# EAGLE design IMU_SMD (EAGLE 7.4.0)
CNAME: Inertia Meaurement Unit; CREVISION: 1.0; DESIGNER: Ye Wang
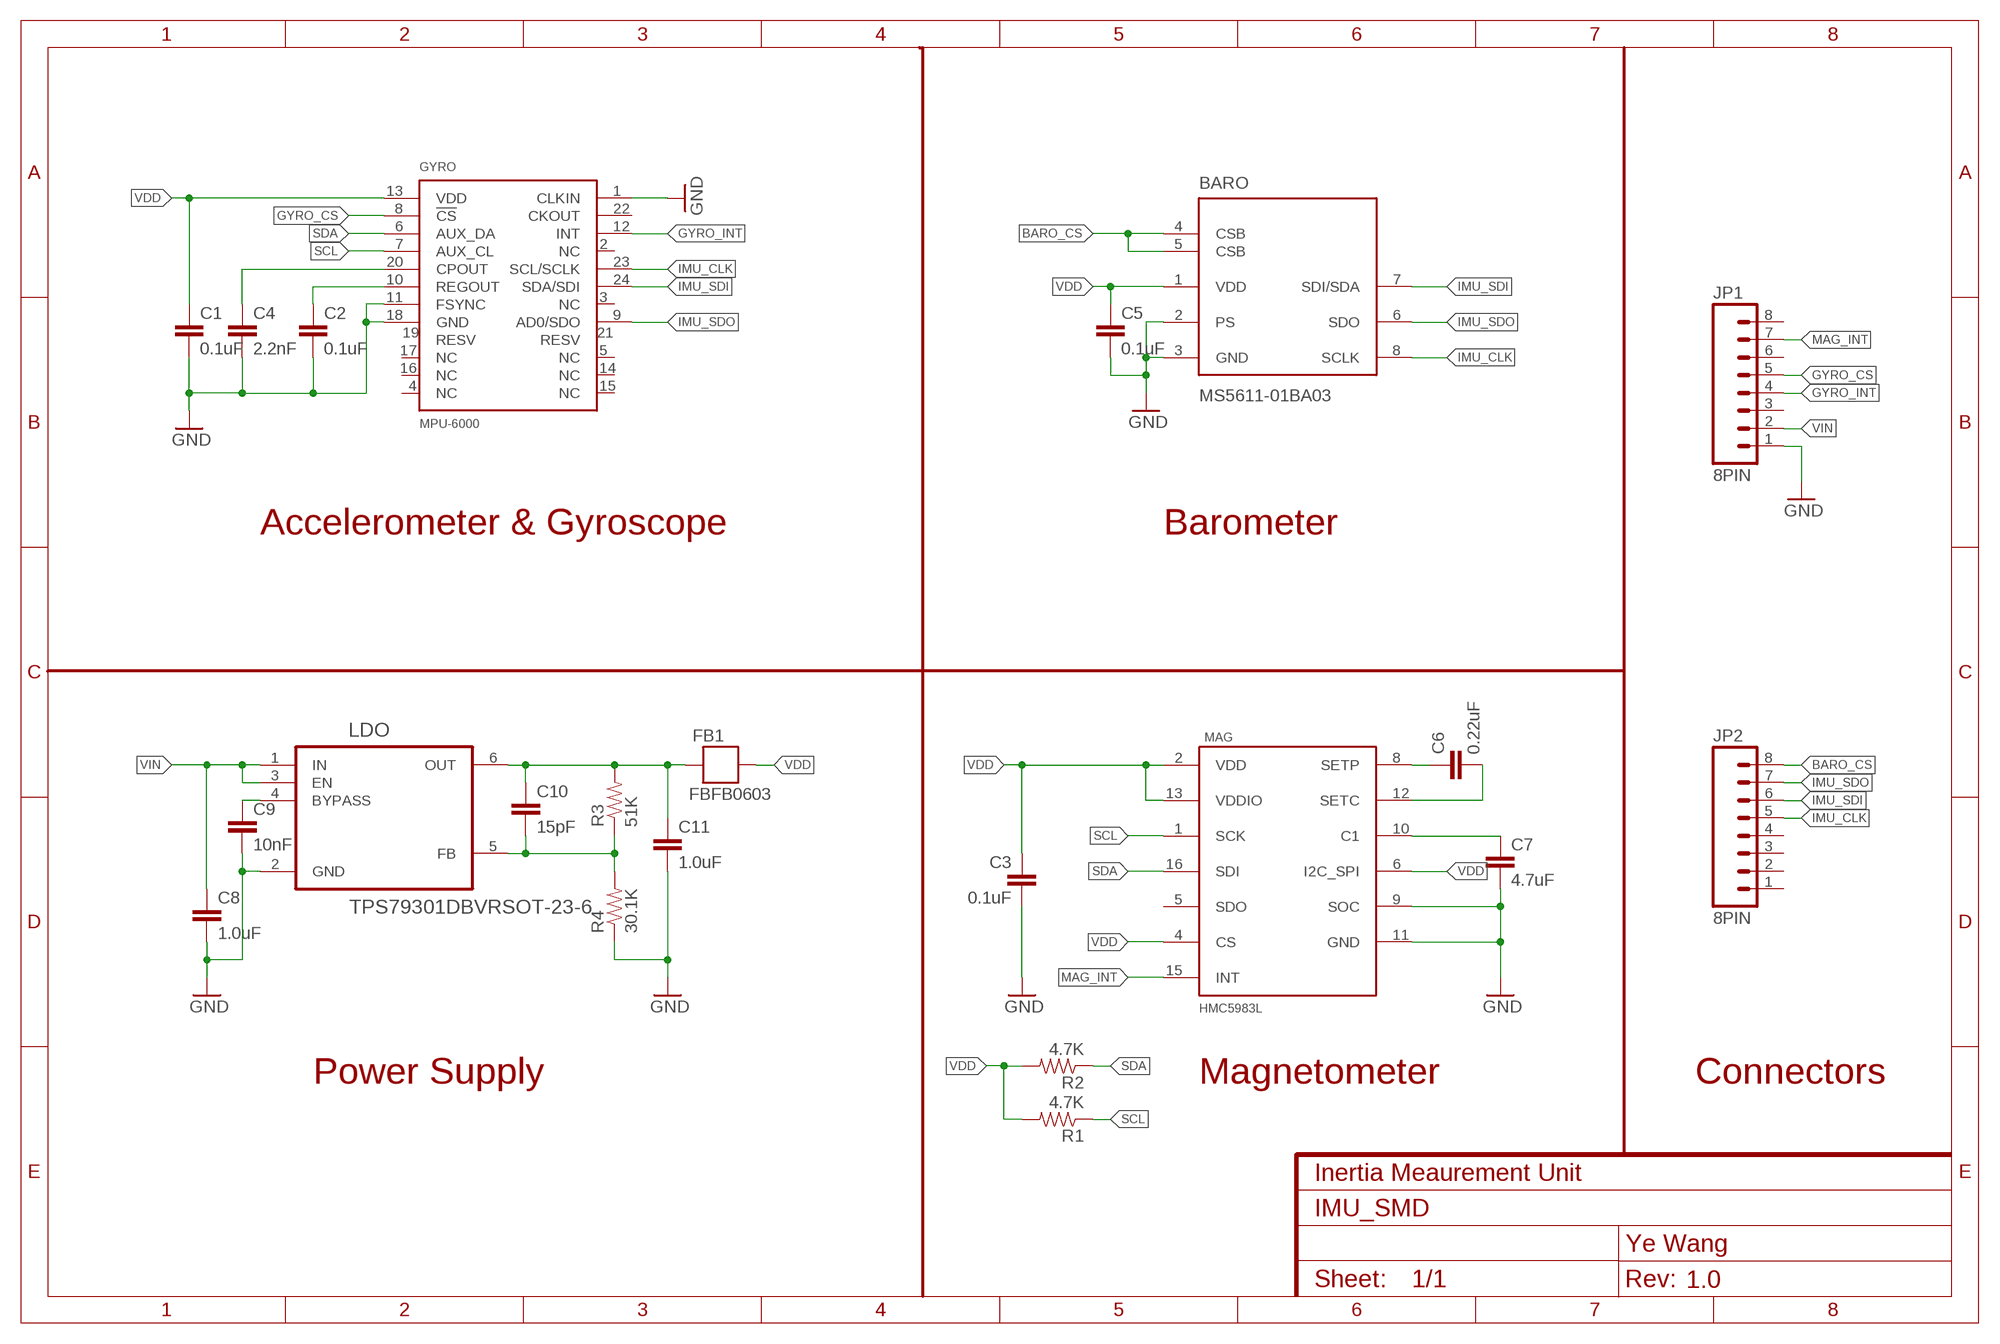
[diagram p0: schematic, sheet 1]

## Parts
BARO  MS5611-01BA03  [SON125P300X500X100-8N]
C1  0.1uF  0.1UF-25V-5%(0603)  [0603-CAP]
C2  0.1uF  0.1UF-25V-5%(0603)  [0603-CAP]
C3  0.1uF  0.1UF-25V-5%(0603)  [0603-CAP]
C4  2.2nF  2.2NF/2200PF-50V-10%(0603)  [0603-CAP]
C5  0.1uF  0.1UF-25V-5%(0603)  [0603-CAP]
C6  0.22uF  0.22UF-25V-10%(0603)  [0603-CAP]
C7  4.7uF  4.7UF-6.3V-10%(0603)0603  [0603-CAP]
C8  1.0uF  1.0UF-16V-10%(0603)  [0603-CAP]
C9  10nF  0.1UF-25V-5%(0603)  [0603-CAP]
C10  15pF  15PF-50V-5%(0603)  [0603-CAP]
C11  1.0uF  1.0UF-16V-10%(0603)  [0603-CAP]
FB1  FBFB0603  [0603]
GYRO  MPU-6000  [QFN24-NO-PAD]
JP1  8PIN  M08SQE  [1X08_SQE_NO_SILK]
JP2  8PIN  M08SQE  [1X08_SQE_NO_SILK]
LDO  TPS79301DBVRSOT-23-6  [SOT95P280X145-6N]
MAG  HMC5983L  [LPCC16]
R1  4.7K  RESISTOR0603-RES  [0603-RES]
R2  4.7K  RESISTOR0603-RES  [0603-RES]
R3  51K  RESISTOR0603-RES  [0603-RES]
R4  30.1K  RESISTOR0603-RES  [0603-RES]

## Nets
BARO_CS: BARO.4(CSB) BARO.5(CSB) JP2.8
GND: BARO.2(PS) BARO.3(GND) C1.2 C2.2 C3.2 C4.2 C5.2 C7.2 C8.2 C9.2 C11.2 GYRO.1(CLKIN) GYRO.11(FSYNC) GYRO.18(GND) JP1.1 LDO.2(GND) MAG.9(SOC) MAG.11(GND) R4.1
GYRO_CS: GYRO.8(!CS) JP1.5
GYRO_INT: GYRO.12(INT) JP1.4
IMU_CLK: BARO.8(SCLK) GYRO.23(SCL/SCLK) JP2.5
IMU_SDI: BARO.7(SDI/SDA) GYRO.24(SDA/SDI) JP2.6
IMU_SDO: BARO.6(SDO) GYRO.9(AD0/SDO) JP2.7
MAG_INT: JP1.7 MAG.15(INT)
N$1: C9.1 LDO.4(BYPASS)
N$2: C10.1 C11.1 FB1.2 LDO.6(OUT) R3.2
N$4: C2.1 GYRO.10(REGOUT)
N$5: C4.1 GYRO.20(CPOUT)
N$6: C10.2 LDO.5(FB) R3.1 R4.2
N$13: C6.1 MAG.8(SETP)
N$14: C6.2 MAG.12(SETC)
N$15: C7.1 MAG.10(C1)
SCL: GYRO.7(AUX_CL) MAG.1(SCK) R1.1
SDA: GYRO.6(AUX_DA) MAG.16(SDI) R2.1
VDD: BARO.1(VDD) C1.1 C3.1 C5.1 FB1.1 GYRO.13(VDD) MAG.2(VDD) MAG.4(CS) MAG.6(I2C_SPI) MAG.13(VDDIO) R1.2 R2.2
VIN: C8.1 JP1.2 LDO.1(IN) LDO.3(EN)
Unconnected: GYRO.2(NC) GYRO.3(NC) GYRO.4(NC) GYRO.5(NC) GYRO.14(NC) GYRO.15(NC) GYRO.16(NC) GYRO.17(NC) GYRO.19(RESV) GYRO.21(RESV) GYRO.22(CKOUT) JP1.3 JP1.6 JP1.8 JP2.1 JP2.2 JP2.3 JP2.4 MAG.5(SDO)

## Notes on the sheet
- Accelerometer & Gyroscope | Barometer
- Power Supply | Magnetometer | Connectors

## Library data of the parts
BARO = Measurement-Specialties:MS5611-01BA03: Variometer Module, with stainless steel cap
C1-C3 C5 = SparkFun-Capacitors:0.1UF-25V-5%(0603): CAP-08604; PROD_ID: CAP-08604
C4 = SparkFun-Capacitors:2.2NF/2200PF-50V-10%(0603): CAP-07877; PROD_ID: CAP-07877
C6 = SparkFun-Capacitors:0.22UF-25V-10%(0603): CAP-07822; PROD_ID: CAP-07822
C7 = SparkFun-Capacitors:4.7UF-6.3V-10%(0603): CAP-08280; PROD_ID: CAP-08280
C8 C11 = SparkFun-Capacitors:1.0UF-16V-10%(0603): CAP-00868; PROD_ID: CAP-00868
C9 = SparkFun-Capacitors:0.1UF-25V-5%(0603): CAP-08604; PROD_ID: CAP-08604; VALUE: 0.1uF
C10 = SparkFun-Capacitors:15PF-50V-5%(0603): CAP-07881; PROD_ID: CAP-07881
FB1 = SparkFun-Passives:FB
GYRO = aspirin:MPU-6000
JP1 JP2 = SparkFun-Connectors:M08: Header 8 Standard 8-pin 0.1" header. Use with straight break away headers (SKU : PRT-00116), right angle break away headers (PRT-00553), swiss pins (PRT-00743), machine pins (PRT-00117), and female headers (PRT-00115).
LDO = ti_misc:TPS79301DBVR: Low Dropout Linear Regulators; MPN: TPS79301DBVR; OC_FARNELL: 1460960; OC_NEWARK: 77C1357; PACKAGE: SOT-23-6; SUPPLIER: Texas Instruments
MAG = Honeywell:HMC5983L: The Honeywell HMC5983 is a temperature compensated three-axis integrated circuit magnetometer. This surface-mount, multi-chip module is designed for low-field magnetic sensing for applications such as automotive and personal navigation, vehicle detection, and pointing.
R1-R4 = SparkFun-Resistors:RESISTOR: Resistor Basic schematic elements and footprints for 0603, 1206, and PTH resistors.

## Board
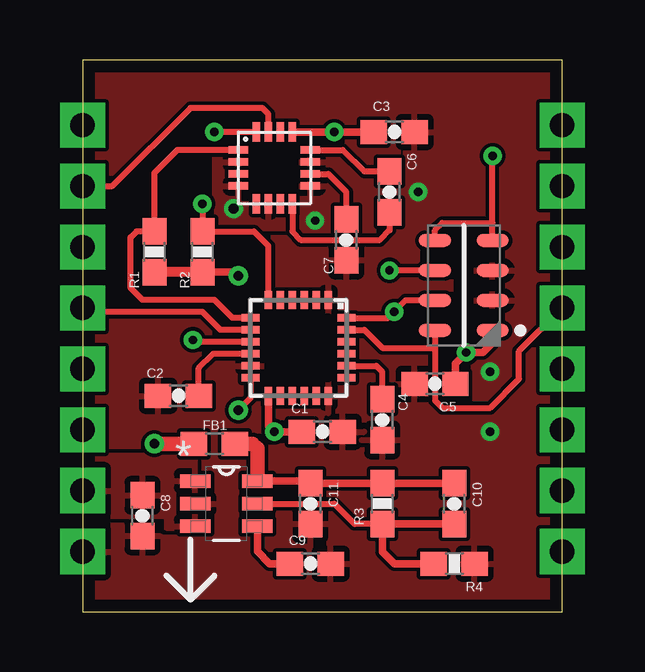
[diagram p1: board, top side]
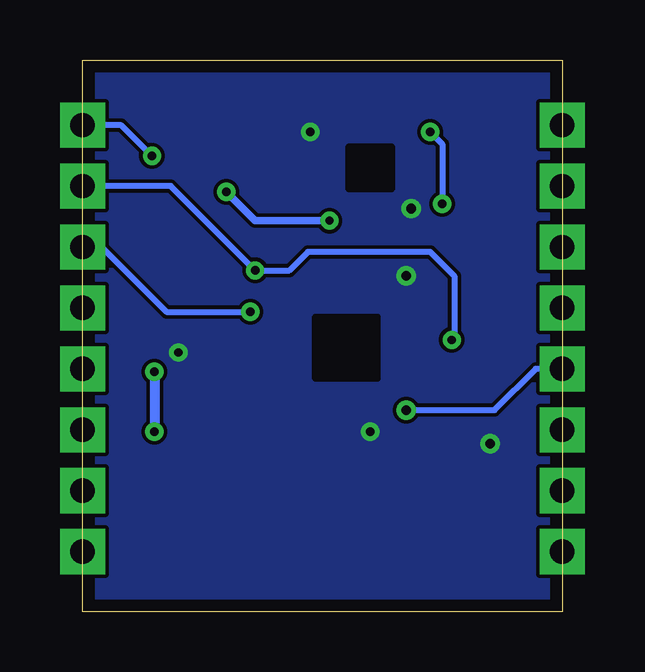
[diagram p2: board, bottom side, seen from below]

Size 20 x 23 mm. Coordinates in mm from the lower left corner, seen from the top.
Outline: 0,0 20,0 20,23 0,23 0,0
Copper layers (1*16): Top 0.035mm / dielectric 1.5mm / Bottom 0.035mm
Design rules "default *": minimum track width 6mil, minimum drill 0.3mm, track to track 6mil, track to pad 6mil, pad to pad 6mil, via to via 6mil, smd to smd 6mil, copper to edge 20mil, drill to drill 8mil, minimum pad ring 10mil, minimum via ring 8mil, stop-mask expansion 4mil, vias tented up to drill 0.6mm, thermal gap 10mil
tRestrict: area 7.1,17.6 to 8.9,19.4; area 7.7,9.7 to 10.3,12.3; area 14.2,11.5 to 17.5,15
bRestrict: area 7.1,17.6 to 8.9,19.4; area 7.7,9.7 to 10.3,12.3

### Footprints (pad centres in the part's own frame; a part is rotated, then mirrored left to right if it is on the bottom)
SON125P300X500X100-8N = smd 1.35 x 0.55: 1 -1.2,1.875; 2 -1.2,0.625; 3 -1.2,-0.625; 4 -1.2,-1.875; 5 1.2,-1.875; 6 1.2,-0.625; 7 1.2,0.625; 8 1.2,1.875
0603-CAP = smd 1.1 x 1: 1 -0.85,0; 2 0.85,0
0603 = smd 1.1 x 1: 1 -0.85,0; 2 0.85,0
QFN24-NO-PAD = smd 0.75 x 0.3: 1 -2,1.25; 2 -2,0.75; 3 -2,0.25; 4 -2,-0.25; 5 -2,-0.75; 6 -2,-1.25; 13 2,-1.25; 14 2,-0.75; 15 2,-0.25; 16 2,0.25; 17 2,0.75; 18 2,1.25 | smd 0.3 x 0.75: 7 -1.25,-2; 8 -0.75,-2; 9 -0.25,-2; 10 0.25,-2; 11 0.75,-2; 12 1.25,-2; 19 1.25,2; 20 0.75,2; 21 0.25,2; 22 -0.25,2; 23 -0.75,2; 24 -1.25,2
1X08_SQE_NO_SILK = drill 1.016 pad 1.88 square: 1 0,0; 2 2.54,0; 3 5.08,0; 4 7.62,0; 5 10.16,0; 6 12.7,0; 7 15.24,0; 8 17.78,0
SOT95P280X145-6N = smd 1.27 x 0.559: 1 -1.295,0.94; 2 -1.295,0; 3 -1.295,-0.94; 4 1.295,-0.94; 5 1.295,0; 6 1.295,0.94
LPCC16 = smd 0.8 x 0.3: 1 -1.5,0.75; 2 -1.5,0.25; 3 -1.5,-0.25; 4 -1.5,-0.75; 9 1.5,-0.75; 10 1.5,-0.25; 11 1.5,0.25; 12 1.5,0.75 | smd 0.3 x 0.8: 5 -0.75,-1.5; 6 -0.25,-1.5; 7 0.25,-1.5; 8 0.75,-1.5; 13 0.75,1.5; 14 0.25,1.5; 15 -0.25,1.5; 16 -0.75,1.5
0603-RES = smd 1.1 x 1: 1 -0.85,0; 2 0.85,0

### Placement (x,y rotation side)
BARO  15.9,13.6 180 top
C1  10,7.5 0 top
C2  4,9 180 top
C3  13,20 0 top
C4  12.5,8 270 top
C5  14.7,9.5 180 top
C6  12.8,17.5 90 top
C7  11,15.5 270 top
C8  2.5,4 270 top
C9  9.5,2 0 top
C10  15.5,4.5 270 top
C11  9.5,4.5 270 top
FB1  5.5,7 0 top
GYRO  9,11 270 top
JP1  0,2.5 90 top
JP2  20,2.5 90 top
LDO  6,4.5 0 top
MAG  8,18.5 0 top
R1  3,15 270 top
R2  5,15 270 top
R3  12.5,4.5 90 top
R4  15.5,2 180 top

### Tracks (layer width: path | path; a pad name or v marks a point on that pad's centre or on a via)
BARO_CS  (via drill 0.35)
  Top 0.254: BARO.5 14.7,15.9 15,16.2 17.1,16.2 | BARO.4 17.1,16.2 | 17.1,16.2 v17.1,19
  Bottom 0.254: v17.1,19 18.38,20.28 JP2.8
GND  (via drill 0.35)
  Bottom 0.305: v9.7,16.3 12.8,16.3 v14,17.5
  Bottom 0.406: v17,10 v17,7.5
  pour Top (rank 2): 0,0 20,0 20,23 0,23
GYRO_CS
  Top 0.254: GYRO.8 5.75,11.75 5,12.5 0.16,12.5 JP1.5
GYRO_INT  (via drill 0.4)
  Top 0.254: GYRO.12 7,8.9 v6.5,8.4
  Bottom 0.254: v6.5,8.4 2.82,8.4 1.1,10.12 JP1.4
IMU_CLK
  Top 0.254: BARO.8 14.7,11 | 14.7,11 14.7,8.8 15,8.5 17,8.5 18.2,9.7 18.2,10.86 JP2.5 | GYRO.23 11.75,11.75 12.5,11 14.7,11
IMU_SDI  (via drill 0.35)
  Top 0.254: BARO.7 13.47,12.97 v13,12.5 12.75,12.25 GYRO.24
  Bottom 0.254: v13,12.5 16.5,12.5 19.2,15.2 JP2.6
IMU_SDO  (via drill 0.35)
  Top 0.254: GYRO.9 4.67,11.25 v4.6,11.32 | BARO.6 v12.8,14.22
  Bottom 0.254: JP2.7 16.32,17.74 v12.8,14.22 11.38,14.22 10.6,15 5.5,15 4.5,14 4.5,11.43 v4.6,11.32
MAG_INT
  Top 0.254: MAG.15 7.75,20.75 7.5,21 4.5,21 1.24,17.74 JP1.7
N$1
  Top 0.305: C9.1 7.8,2 7.29,2.5 LDO.4
N$2
  Top 0.305: C10.1 R3.2 C11.1 9.41,5.44 LDO.6
  Top 0.61: LDO.6 7.29,6.8 7.1,7 FB1.2
N$4
  Top 0.254: C2.1 4.85,10.15 5.45,10.75 GYRO.10
N$5
  Top 0.254: GYRO.20 12.25,10.25 12.5,10 C4.1
N$6
  Top 0.254: LDO.5 10.5,4.5 11.35,3.65 R3.1
  Top 0.305: C10.2 R3.1 12.5,2.5 13,2 R4.2
N$13
  Top 0.254: MAG.8 8.75,15.85 9.1,15.5 12.4,15.5 12.8,15.9 C6.1
N$14
  Top 0.254: MAG.12 10.85,19.25 11.75,18.35 C6.2
N$15
  Top 0.254: MAG.10 10.25,18.25 11,17.5 C7.1
SCL
  Top 0.254: MAG.1 3.95,19.25 3,18.3 R1.1 2.25,15.85 2,15.6 2,13.5 2.5,13 5.5,13 6.25,12.25 GYRO.7
SDA  (via drill 0.35)
  Top 0.254: GYRO.6 7.75,15.25 7.15,15.85 R2.1 v5,17 | MAG.16 v5.5,20
  Bottom 0.254: v5,17 5,19.5 v5.5,20
VDD  (via drill 0.35, 0.4)
  Top 0.305: GYRO.13 7.75,7.75 v8,7.5 C1.1 | C5.1 15.55,10.35 v16,10.8 16.7,10.8 17.1,11.2 BARO.1 | MAG.13 v10.5,20 C3.1 | R2.2 6.35,14.15 v6.5,14
  Top 0.406: R2.2 R1.2
  Top 0.61: FB1.1 v3,7
  other vias: 6.3,16.8
  pour Bottom (rank 2): 0,0 20,0 20,23 0,23
  pour Top: 6.5,19 5.5,19 5.5,16 8.5,16 8.5,17 6.5,17
VIN
  pour Top: 0,4 3.5,4 3.5,3.5 4.7,3.5 4.7,6.5 0,6.5